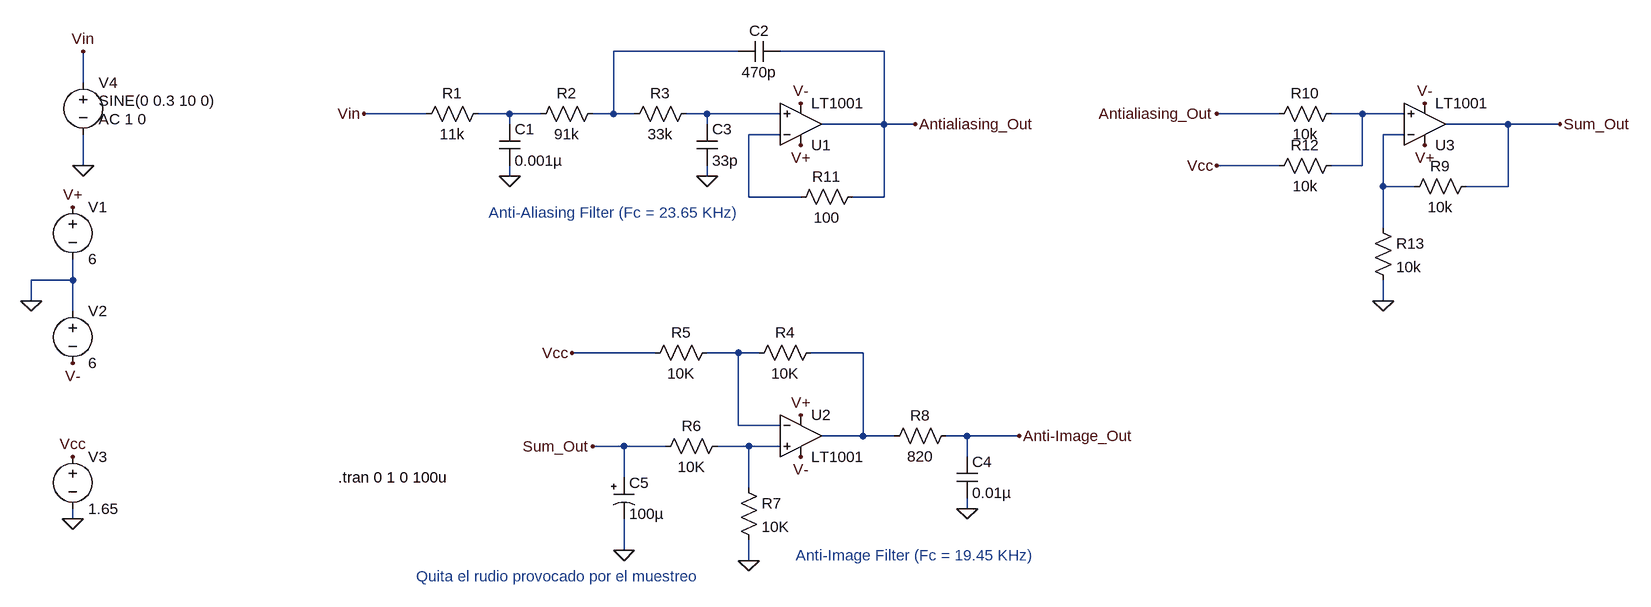
[diagram p0: schematic Filtro Antialias.asc]
Filtro Antialias.asc, the LTspice schematic file:
Version 4
SHEET 1 1932 1204
WIRE -400 -960 -592 -960
WIRE -176 -960 -336 -960
WIRE -1408 -912 -1408 -960
WIRE -880 -864 -976 -864
WIRE -752 -864 -800 -864
WIRE -704 -864 -752 -864
WIRE -592 -864 -592 -960
WIRE -592 -864 -624 -864
WIRE -560 -864 -592 -864
WIRE -448 -864 -480 -864
WIRE -336 -864 -448 -864
WIRE 432 -864 336 -864
WIRE 560 -864 512 -864
WIRE 624 -864 560 -864
WIRE -752 -848 -752 -864
WIRE -448 -848 -448 -864
WIRE -176 -848 -176 -960
WIRE -176 -848 -272 -848
WIRE -128 -848 -176 -848
WIRE 784 -848 688 -848
WIRE 864 -848 784 -848
WIRE -336 -832 -384 -832
WIRE 624 -832 592 -832
WIRE -1408 -784 -1408 -832
WIRE 432 -784 336 -784
WIRE 560 -784 560 -864
WIRE 560 -784 512 -784
WIRE -752 -768 -752 -784
WIRE -448 -768 -448 -784
WIRE 592 -752 592 -832
WIRE 640 -752 592 -752
WIRE 784 -752 784 -848
WIRE 784 -752 720 -752
WIRE -384 -736 -384 -832
WIRE -304 -736 -384 -736
WIRE -176 -736 -176 -848
WIRE -176 -736 -224 -736
WIRE 592 -688 592 -752
WIRE -1424 -608 -1424 -640
WIRE -1424 -608 -1488 -608
WIRE -1488 -576 -1488 -608
WIRE 592 -576 592 -608
WIRE -1424 -560 -1424 -608
WIRE -528 -496 -656 -496
WIRE -400 -496 -448 -496
WIRE -368 -496 -400 -496
WIRE -208 -496 -288 -496
WIRE -400 -384 -400 -496
WIRE -336 -384 -400 -384
WIRE -208 -368 -208 -496
WIRE -208 -368 -272 -368
WIRE -160 -368 -208 -368
WIRE -48 -368 -80 -368
WIRE 32 -368 -48 -368
WIRE -576 -352 -624 -352
WIRE -512 -352 -576 -352
WIRE -384 -352 -432 -352
WIRE -336 -352 -384 -352
WIRE -48 -336 -48 -368
WIRE -576 -304 -576 -352
WIRE -384 -288 -384 -352
WIRE -48 -256 -48 -272
WIRE -1424 -240 -1424 -256
WIRE -576 -192 -576 -240
WIRE -384 -176 -384 -208
FLAG -448 -768 0
FLAG -752 -768 0
FLAG -1488 -576 0
FLAG -1424 -720 V+
FLAG -1424 -480 V-
FLAG -1424 -240 0
FLAG -1424 -336 Vcc
FLAG -304 -816 V+
FLAG -304 -880 V-
FLAG -1408 -784 0
FLAG -1408 -960 Vin
FLAG -48 -256 0
FLAG -384 -176 0
FLAG -128 -848 Antialiasing_Out
FLAG 32 -368 Anti-Image_Out
FLAG 592 -576 0
FLAG 656 -816 V+
FLAG 656 -880 V-
FLAG 336 -784 Vcc
FLAG 864 -848 Sum_Out
FLAG -304 -400 V+
FLAG -304 -336 V-
FLAG -976 -864 Vin
FLAG 336 -864 Antialiasing_Out
FLAG -624 -352 Sum_Out
FLAG -656 -496 Vcc
FLAG -576 -192 0
SYMBOL Opamps\\LT1001 -304 -784 M180
SYMATTR InstName U1
SYMBOL cap -464 -848 R0
SYMATTR InstName C3
SYMATTR Value 33p
SYMBOL cap -336 -976 R90
WINDOW 0 0 32 VBottom 2
WINDOW 3 32 32 VTop 2
SYMATTR InstName C2
SYMATTR Value 470p
SYMBOL cap -768 -848 R0
SYMATTR InstName C1
SYMATTR Value 0.001µ
SYMBOL res -464 -880 R90
WINDOW 0 0 56 VBottom 2
WINDOW 3 32 56 VTop 2
SYMATTR InstName R3
SYMATTR Value 33k
SYMBOL res -608 -880 R90
WINDOW 0 0 56 VBottom 2
WINDOW 3 32 56 VTop 2
SYMATTR InstName R2
SYMATTR Value 91k
SYMBOL res -784 -880 R90
WINDOW 0 0 56 VBottom 2
WINDOW 3 32 56 VTop 2
SYMATTR InstName R1
SYMATTR Value 11k
SYMBOL voltage -1424 -736 R0
WINDOW 123 0 0 Left 2
WINDOW 39 0 0 Left 2
SYMATTR InstName V1
SYMATTR Value 6
SYMBOL voltage -1424 -576 R0
WINDOW 123 0 0 Left 2
WINDOW 39 0 0 Left 2
SYMATTR InstName V2
SYMATTR Value 6
SYMBOL voltage -1424 -352 R0
WINDOW 123 0 0 Left 2
WINDOW 39 0 0 Left 2
SYMATTR InstName V3
SYMATTR Value 1.65
SYMBOL voltage -1408 -928 R0
WINDOW 3 24 44 Left 2
WINDOW 123 24 72 Left 2
WINDOW 39 0 0 Left 2
SYMATTR Value SINE(0 0.3 10 0)
SYMATTR Value2 AC 1 0
SYMATTR InstName V4
SYMBOL Opamps\\LT1001 -304 -432 R0
SYMATTR InstName U2
SYMBOL res -272 -512 R90
WINDOW 0 0 56 VBottom 2
WINDOW 3 32 56 VTop 2
SYMATTR InstName R4
SYMATTR Value 10K
SYMBOL res -432 -512 R90
WINDOW 0 0 56 VBottom 2
WINDOW 3 32 56 VTop 2
SYMATTR InstName R5
SYMATTR Value 10K
SYMBOL res -528 -336 R270
WINDOW 0 32 56 VTop 2
WINDOW 3 0 56 VBottom 2
SYMATTR InstName R6
SYMATTR Value 10K
SYMBOL res -400 -304 R0
SYMATTR InstName R7
SYMATTR Value 10K
SYMBOL res -64 -384 R90
WINDOW 0 0 56 VBottom 2
WINDOW 3 32 56 VTop 2
SYMATTR InstName R8
SYMATTR Value 820
SYMBOL cap -64 -336 R0
SYMATTR InstName C4
SYMATTR Value 0.01µ
SYMBOL res -208 -752 R90
WINDOW 0 0 56 VBottom 2
WINDOW 3 32 56 VTop 2
SYMATTR InstName R11
SYMATTR Value 100
SYMBOL Opamps\\LT1001 656 -784 M180
SYMATTR InstName U3
SYMBOL res 528 -880 R90
WINDOW 0 0 56 VBottom 2
WINDOW 3 32 56 VTop 2
SYMATTR InstName R10
SYMATTR Value 10k
SYMBOL res 528 -800 R90
WINDOW 0 0 56 VBottom 2
WINDOW 3 32 56 VTop 2
SYMATTR InstName R12
SYMATTR Value 10k
SYMBOL res 736 -768 R90
WINDOW 0 0 56 VBottom 2
WINDOW 3 32 56 VTop 2
SYMATTR InstName R9
SYMATTR Value 10k
SYMBOL res 576 -704 R0
SYMATTR InstName R13
SYMATTR Value 10k
SYMBOL polcap -592 -304 R0
SYMATTR InstName C5
SYMATTR Value 100µ
TEXT -1016 -304 Left 2 !.tran 0 1 0 100u
TEXT -784 -712 Left 2 ;Anti-Aliasing Filter (Fc = 23.65 KHz)
TEXT -312 -184 Left 2 ;Anti-Image Filter (Fc = 19.45 KHz)
TEXT -896 -152 Left 2 ;Quita el rudio provocado por el muestreo

The netlist it stands for:
* Filtro Antialias.asc
XU1 N003 N005 V+ V- Antialiasing_Out LT1001  ; pins In+ In- V+ V- OUT
C3 N003 0 33p
C2 Antialiasing_Out N001 470p
C1 N002 0 0.001µ
R3 N003 N001 33k
R2 N001 N002 91k
R1 N002 Vin 11k
V1 V+ 0 6
V2 0 V- 6
V3 Vcc 0 1.65
V4 Vin 0 SINE(0 0.3 10 0) AC 1 0
XU2 N009 N007 V+ V- N008 LT1001  ; pins In+ In- V+ V- OUT
R4 N008 N007 10K
R5 N007 Vcc 10K
R6 Sum_Out N009 10K
R7 N009 0 10K
R8 Anti-Image_Out N008 820
C4 Anti-Image_Out 0 0.01µ
R11 Antialiasing_Out N005 100
XU3 N004 N006 V+ V- Sum_Out LT1001  ; pins In+ In- V+ V- OUT
R10 N004 Antialiasing_Out 10k
R12 N004 Vcc 10k
R9 Sum_Out N006 10k
R13 N006 0 10k
C5 Sum_Out 0 100µ
.tran 0 1 0 100u
* Anti-Aliasing Filter (Fc = 23.65 KHz)
* Anti-Image Filter (Fc = 19.45 KHz)
* Quita el rudio provocado por el muestreo
.lib LTC.lib
.backanno
.end